# Altium project MC3_r2.PrjPcb (part 10 of 10)

## Sheet FaultOptoNO.SchDoc
size Letter; Organization: Altium Limited; Address1: L3, 12a Rodborough Rd; Address2: Frenchs Forest; Address3: NSW; Address4: Australia 2086; DocumentNumber: D_10; SheetNumber: 10; SheetTotal: 21
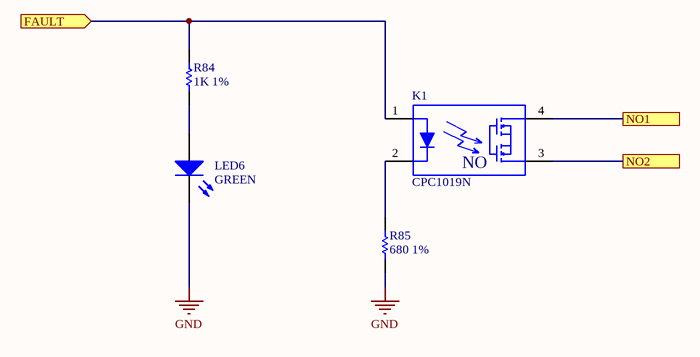
[diagram p20: FaultOptoNO.SchDoc]

### Parts
K1  CPC1019N  [SOP254P610X206-4N]
LED6  GREEN  [LED0805]
R84  1K 1%  [R0805]
R85  680 1%  [R0805]

### Ports
FAULT (in), NO1, NO2

### Nets
GND: LED6.1(K) R85.1
COOL_RET: K1.3 ; port NO2
COOL_TEMP_INa: K1.4 ; port NO1
F_Cool-Short: K1.1 R84.1 ; port FAULT
NetK1_2: K1.2 R85.2
NetLED6_2: LED6.2(A) R84.2

### Notes on the sheet
- Title
- Size:
- Date:
- Letter
- Number:
- Time:
- Revision:
- Sheet
- of
- Fluid Power Training
- Institute Inc.
- 2170 S 3040 W
- Salt Lake City, 84119,UT.
- United States.
- File:
- (in symbol CPC1019N) NO

### Library data of the parts
K1 = CPC1019N: Relay SSR 50mA 1.4V DC-IN 0.75A 60V AC-OUT 4-Pin SOP Tube; Manufacturer: Ixys Clare; Output Current: 750mA; Throw Configuration: SPST; Isolation Voltage: 1.5kV; Supplier 1: Mouser; Supplier Part Number 1: 849-CPC1019N; Manufacturer Part Number: CPC1019N; RoHS: Yes; Category: Solid State Relays; Stock 1: 6539; Pricing 1: 1=1.76000, 10=1.61000, 20=1.47000, 50=1.41000, 100=1.34000, 200=1.19000 (USD); Mount: Surface Mount; Case/Package: SOP; Number of Pins: 4; Min Operating Temperature: -40°C; Max Operating Temperature: 85°C; Packaging: Rail/Tube; Package Quantity: 100; Termination: Gull Wing; Max Output Voltage: 60V; Input Current: 50mA; Length: 4.089mm; Height: 2.184mm; Width: 3.8mm; Radiation Hardening: No; ComponentLink1URL: http://components.arrow.com/part/dataview/0323_06647336?src-supplier=Arrow+Europe; ComponentLink1Description: http://components.arrow.com/part/dataview/0323_06647336?src-supplier=Arrow+Europe; ComponentLink2URL: http://www.mouser.com/ds/2/205/CPC1019N-594134.pdf?src-supplier=Mouser; ComponentLink2Description: http://www.mouser.com/ds/2/205/CPC1019N-594134.pdf?src-supplier=Mouser; ComponentLink3URL: http://components.arrow.com/part/dataview/47904908S477565N2018?src-supplier=Arrow; ComponentLink3Description: http://components.arrow.com/part/dataview/47904908S477565N2018?src-supplier=Arrow; ComponentLink4URL: http://www.ixysic.com/home/pdfs.nsf/www/CPC1019N.pdf/$file/CPC1019N.pdf?src-supplier=Digi-Key; ComponentLink4Description: http://www.ixysic.com/home/pdfs.nsf/www/CPC1019N.pdf/$file/CPC1019N.pdf?src-supplier=Digi-Key
LED6 = 150080VS75000: LED GREEN CLEAR 0805 SMD; Manufacturer: Wurth Electronics; Viewing Angle: 140°; Lens Style: Clear,Rectangular; Forward Voltage: 2V; Luminous Intensity: 40mcd; Dominant Wavelength: 570nm; Forward Current: 30mA; Test Current: 20mA; Supplier 1: Mouser; Supplier Part Number 1: 710-150080VS75000; Manufacturer Part Number: 150080VS75000; RoHS: Yes; Category: LEDs; Stock 1: 16574; Pricing 1: 1=0.18000, 10=0.17500, 25=0.17400, 50=0.16200, 100=0.13900, 250=0.12300 (USD); Mount: Surface Mount; Case/Package: 0805; Color: Green; Case Code (Metric): 2012; Case Code (Imperial): 0805; Min Operating Temperature: -40°C; Max Operating Temperature: 85°C; Packaging: Tape and Reel; Package Quantity: 4000; Wavelength: 570nm; Length: 2mm; Height: 0.7mm; Width: 1.25mm; REACH SVHC: Unknown; ComponentLink1URL: https://datasheet.ciiva.com/22656/150080vs75000-22656966.pdf?src-supplier=Element14; ComponentLink1Description: https://datasheet.ciiva.com/22656/150080vs75000-22656966.pdf?src-supplier=Element14; ComponentLink2URL: https://datasheet.ciiva.com/29279/759437-da-01-en-chipled-0805-w-kl-h-gruen-150080vs7500-29279047.pdf?src-supplier=Conrad; ComponentLink2Description: https://datasheet.ciiva.com/29279/759437-da-01-en-chipled-0805-w-kl-h-gruen-150080vs7500-29279047.pdf?src-supplier=Conrad; ComponentLink3URL: https://datasheet.ciiva.com/29563/150080vs75000-29563018.pdf?src-supplier=Digi-Key; ComponentLink3Description: https://datasheet.ciiva.com/29563/150080vs75000-29563018.pdf?src-supplier=Digi-Key
R84 = RC0805FR-071KL: RESISTOR, 0805 1K 1%, FULL REEL; Product Range:YAGEO - RC Series; Resistance:1kohm; Power Rating:125mW; Resistance Tolerance:± 1%; Resistor Case Style:0805 [2012 Metric]; Resistor Element Material:Thick Film; Temperature Coefficient:± 250ppm/°C; Voltage Rating:150V; Packaging:Tape & Reel; MSL:-; SVHC:No SVHC (16-Dec-2013); External Depth:0.55mm; External Length / Height:2mm; External Width:1.25mm; No. of Pins:2; Operating Temperature Max:155°C; Operating Temperature Min:-55°C; Operating Temperature Range:-55°C to +155°C; Reel Quantity:5000; Resistor Mounting:SMD; Series:RC12H; Temperature Coef; Manufacturer: Yageo; Resistance: 1kR; Temperature Coefficient: 100ppm/°C; Power Rating: 125mW; Voltage Rating: 150V; Supplier 1: Mouser; Manufacturer Part Number: RC0805FR-071KL; RoHS: Yes; Stock 1: 1519412; Pricing 1: 1=0.13000, 10=0.03100, 100=0.01100, 1000=0.00800, 5000=0.00500, 10000=0.00500 (USD); ComponentLink1URL: https://datasheet.ciiva.com/2456/pyu-r-int-thick-7-2456976.pdf?src-supplier=Digi-Key; ComponentLink1Description: https://datasheet.ciiva.com/2456/pyu-r-int-thick-7-2456976.pdf?src-supplier=Digi-Key; ComponentLink2URL: https://datasheet.ciiva.com/2456/pyu-r-int-thick-7-2456977.pdf?src-supplier=Digi-Key; ComponentLink2Description: https://datasheet.ciiva.com/2456/pyu-r-int-thick-7-2456977.pdf?src-supplier=Digi-Key; Supplier Part Number 1: 603-RC0805FR-071KL; Category: Chip SMD Resistors; Case/Package: 0805; Case Code (Imperial): 0805; Case Code (Metric): 2012; Min Operating Temperature: -55°C; Max Operating Temperature: 155°C; Tolerance: 1%; Packaging: Tape and Reel; Composition: Thick Film; Termination: SMD/SMT; Voltage Rating (DC): 150V; Package Quantity: 1; Military Standard: Not; Length: 0.079inch; Height: 0.024inch; Width: 0.049inch; Depth: 1.25mm; Lead Free: Lead Free; REACH SVHC: Unknown; ComponentLink3URL: https://datasheet.ciiva.com/7941/1686128-7941719.pdf?src-supplier=Element14; ComponentLink3Description: https://datasheet.ciiva.com/7941/1686128-7941719.pdf?src-supplier=Element14; ComponentLink4URL: https://datasheet.ciiva.com/16850/rc0805-16850409.pdf?src-supplier=Future+Electronics; ComponentLink4Description: https://datasheet.ciiva.com/16850/rc0805-16850409.pdf?src-supplier=Future+Electronics; ComponentLink5URL: https://datasheet.ciiva.com/46385/444164-46385020.pdf?src-supplier=Element14; ComponentLink5Description: https://datasheet.ciiva.com/46385/444164-46385020.pdf?src-supplier=Element14; ComponentLink6URL: https://datasheet.ciiva.com/2456/pyu-r-int-thick-7-2456975.pdf?src-supplier=Digi-Key; ComponentLink6Description: https://datasheet.ciiva.com/2456/pyu-r-int-thick-7-2456975.pdf?src-supplier=Digi-Key; Number of Pins: 2; Number of Terminations: 2; Max Power Dissipation: 125mW; Features: Moisture Resistant
R85 = ERJ6ENF6800V: 680 ohm, 125 mW,  1%, 150 V,PANASONIC ELECTRONIC COMPONENTS         ERJ6ENF6800V            Surface Mount Chip Resistor, Thick Film, AEC-Q200 ERJ6E Series,; Resistance: 680R; Temperature Coefficient: 100ppm/°C; Power Rating: 125mW; Voltage Rating: 150V; Supplier 1: Mouser; Supplier Part Number 1: 667-ERJ-6ENF6800V; Manufacturer: Panasonic; Manufacturer Part Number: ERJ6ENF6800V; RoHS: Yes; Category: Chip SMD Resistors; Stock 1: 59996; Pricing 1: 1=0.11000, 10=0.07200, 100=0.02800, 1000=0.01900, 5000=0.01700, 10000=0.01500 (USD); Mount: Surface Mount; Case/Package: 0805; Number of Pins: 2; Case Code (Metric): 2012; Case Code (Imperial): 0805; Contact Plating: Tin; Min Operating Temperature: -55°C; Max Operating Temperature: 155°C; Packaging: Tape and Reel; Tolerance: 1%; Composition: Thick Film; Termination: SMD/SMT; Number of Terminations: 2; Max Power Dissipation: 125mW; Package Quantity: 1; Features: Automotive AEC-Q200; Military Standard: Not; Length: 2mm; Height: 0.6mm; Width: 0.049inch; Depth: 1.25mm; Radiation Hardening: No; REACH SVHC: No SVHC; ComponentLink1URL: https://datasheet.ciiva.com/11821/0900766b80f80784-11821688.pdf?src-supplier=RSComponents; ComponentLink1Description: https://datasheet.ciiva.com/11821/0900766b80f80784-11821688.pdf?src-supplier=RSComponents; ComponentLink2URL: https://datasheet.ciiva.com/16787/70260748-16787589.pdf?src-supplier=Allied+Electronics; ComponentLink2Description: https://datasheet.ciiva.com/16787/70260748-16787589.pdf?src-supplier=Allied+Electronics; ComponentLink3URL: https://datasheet.ciiva.com/9180/aoa0000ce2-9180429.pdf?src-supplier=Avnet; ComponentLink3Description: https://datasheet.ciiva.com/9180/aoa0000ce2-9180429.pdf?src-supplier=Avnet; ComponentLink4URL: https://datasheet.ciiva.com/7944/426256-7944661.pdf?src-supplier=Element14; ComponentLink4Description: https://datasheet.ciiva.com/7944/426256-7944661.pdf?src-supplier=Element14; ComponentLink5URL: https://datasheet.ciiva.com/16512/aoa0000ce2-16512058.pdf?src-supplier=Avnet+Asia; ComponentLink5Description: https://datasheet.ciiva.com/16512/aoa0000ce2-16512058.pdf?src-supplier=Avnet+Asia; ComponentLink6URL: https://datasheet.ciiva.com/16757/70260748-16757933.pdf?src-supplier=Allied+Electronics; ComponentLink6Description: https://datasheet.ciiva.com/16757/70260748-16757933.pdf?src-supplier=Allied+Electronics; ComponentLink7URL: https://datasheet.ciiva.com/30107/aoa0000ce2-30107005.pdf?src-supplier=Onlinecomponents.com; ComponentLink7Description: https://datasheet.ciiva.com/30107/aoa0000ce2-30107005.pdf?src-supplier=Onlinecomponents.com; ComponentLink8URL: https://datasheet.ciiva.com/46373/1678782-46373887.pdf?src-supplier=Element14; ComponentLink8Description: https://datasheet.ciiva.com/46373/1678782-46373887.pdf?src-supplier=Element14; ComponentLink9URL: https://datasheet.ciiva.com/17205/aoa0000ce2-17205287.pdf?src-supplier=Avnet+Europe; ComponentLink9Description: https://datasheet.ciiva.com/17205/aoa0000ce2-17205287.pdf?src-supplier=Avnet+Europe; ComponentLink10URL: https://datasheet.ciiva.com/7944/426256-7944953.pdf?src-supplier=Element14; ComponentLink10Description: https://datasheet.ciiva.com/7944/426256-7944953.pdf?src-supplier=Element14; ComponentLink11URL: https://datasheet.ciiva.com/5860/426256-5860698.pdf?src-supplier=Farnell; ComponentLink11Description: https://datasheet.ciiva.com/5860/426256-5860698.pdf?src-supplier=Farnell; ComponentLink12URL: https://datasheet.ciiva.com/46373/1678782-46373886.pdf?src-supplier=Element14; ComponentLink12Description: https://datasheet.ciiva.com/46373/1678782-46373886.pdf?src-supplier=Element14

## Nets that join several sheets
+3V3: Main_Connectors (C3.1 X2.26), MC3_microcontroller (18 pins), I2cLevelShifter (6 pins), RPM Inputs (OK1.4 R39.2), AD_Sensors (D7.2), DigitalInputs (R76.2), DCMotorControl (C68.1 IC2.6), TPS_secondary_wiper (C70.1 U17.5), PowerSupply (7 pins)
+5V: Main_Connectors (X2.19 X2.20), I2cLevelShifter (R81.2 R88.2 R95.2), AD_starter_alternator (5 pins), U_MC3_blocks/U_MC3_module/U_CAN2 (C12_U_CAN2.2 C13_U_CAN2.2 U3_U_CAN2.3), PowerSupply (10 pins)
+5VSW: U_MC3_blocks/U_MC3_module/U_CAN (C12_U_CAN.2 C13_U_CAN.2 U3_U_CAN.3), RPM Inputs (C26.1 U4.5), AD_Sensors (6 pins), PowerSupply (C51.2 TP10.1 U14.1)
+8VREF: AD_Sensors (11 pins), PowerSupply (C55.1 TP12.1 U16.1)
+V24V: Main_Connectors (X1.1 X1.3 X1.5), MC_Connector (D4.1), U_MC3_blocks/U_MC3_module/U_MC_Connector/RLA (RL3_RLA.1), U_MC3_blocks/U_MC3_module/U_MC_Connector/RLB (RL3_RLB.1), U_MC3_blocks/U_MC3_module/U_MC_Connector/RLC (RL3_RLC.1), U_MC3_blocks/U_MC3_module/U_MC_Connector/RLD (RL3_RLD.1), U_MC3_blocks/U_MC3_module/U_MC_Connector/RLE (RL3_RLE.1), U_MC3_blocks/U_MC3_module/U_MC_Connector/RLF (RL3_RLF.1), PowerSupply (C44.1 C45.2 D9.2 U12.1), CanFaults (C14.2 C15.2 C16.2), U_MC3_blocks/U_CanFaults/A1P (D3_A1P.2 R32_A1P.1 RL2_A1P.1), U_MC3_blocks/U_CanFaults/A1N (D3_A1N.2 R32_A1N.1 RL2_A1N.1), U_MC3_blocks/U_CanFaults/B1P (D3_B1P.2 R32_B1P.1 RL2_B1P.1), U_MC3_blocks/U_CanFaults/B1N (D3_B1N.2 R32_B1N.1 RL2_B1N.1), U_MC3_blocks/U_CanFaults/C1P (D3_C1P.2 R32_C1P.1 RL2_C1P.1), U_MC3_blocks/U_CanFaults/C1N (D3_C1N.2 R32_C1N.1 RL2_C1N.1), U_MC3_blocks/U_CanFaults/CONA (D2_CONA.2 RL1_CONA.1), U_MC3_blocks/U_CanFaults/CONB (D2_CONB.2 RL1_CONB.1), U_MC3_blocks/U_CanFaults/CONC (D2_CONC.2 RL1_CONC.1)
+V24V_IN: Main_Connectors (X2.1 X2.3), PowerSupply (D9.1)
GND: Main_Connectors (10 pins), MC3_module (7 pins), U_MC3_blocks/U_MC3_module/U_CAN (5 pins), MC3_microcontroller (32 pins), RPM Inputs (10 pins), AD_starter_alternator (10 pins), AD_Sensors (30 pins), DigitalInputs (C57.2 D11.1 Q13.2 R78.1), MC_Connector (Q3.2), DCMotorControl (9 pins), TPS_secondary_wiper (5 pins), U_MC3_blocks/U_MC3_module/U_CAN2 (5 pins), PowerSupply (19 pins), CanFaults (9 pins), U_MC3_blocks/U_CanFaults/A1P (Q2_A1P.2), U_MC3_blocks/U_CanFaults/A1N (Q2_A1N.2), U_MC3_blocks/U_CanFaults/B1P (Q2_B1P.2), U_MC3_blocks/U_CanFaults/B1N (Q2_B1N.2), U_MC3_blocks/U_CanFaults/C1P (Q2_C1P.2), U_MC3_blocks/U_CanFaults/C1N (Q2_C1N.2), U_MC3_blocks/U_CanFaults/CONA (Q1_CONA.2), U_MC3_blocks/U_CanFaults/CONB (Q1_CONB.2), U_MC3_blocks/U_CanFaults/CONC (Q1_CONC.2), U_MC3_blocks/U_Fault_Module/U_FaultOptoNC (LED7_U_MC3_blocks_U_Fault_Module_U_FaultOptoNC#1.1 R87_U_MC3_blocks_U_Fault_Module_U_FaultOptoNC#1.1), U_MC3_blocks/U_Fault_Module/U_FaultOptoNC (LED7_U_MC3_blocks_U_Fault_Module_U_FaultOptoNC#2.1 R87_U_MC3_blocks_U_Fault_Module_U_FaultOptoNC#2.1), U_MC3_blocks/U_Fault_Module/U_FaultOptoNC (LED7_U_MC3_blocks_U_Fault_Module_U_FaultOptoNC#3.1 R87_U_MC3_blocks_U_Fault_Module_U_FaultOptoNC#3.1), FaultOptoNO (LED6.1 R85.1)
~{SPEED_DIAG}: MC3_microcontroller (U1.11), RPM Inputs (Q4.1)
~{SPEED_EN}: MC3_microcontroller (U1.10), RPM Inputs (U4.4)
AD_MOTOR: MC3_microcontroller (U1.27), DCMotorControl (C69.1 R92.1)
ADSRDY: MC3_microcontroller (U1.57), I2cLevelShifter (Q18.2 R94.1 TP18.1)
ADSRDY5V: I2cLevelShifter (Q18.3 R95.1 TP19.1), AD_starter_alternator (IC1.2)
ALTERNATOR_AMP: Main_Connectors (X2.22), MC3_module (BH37.1), AD_starter_alternator (R33.1 R34.2)
ALTERNATOR_VREF: Main_Connectors (X2.18), AD_starter_alternator (R35.1)
B_CANH_A: CanFaults (BH1.1 R14.2), U_MC3_blocks/U_CanFaults/A1P (RL2_A1P.2 RL2_A1P.6), U_MC3_blocks/U_CanFaults/CONA (RL1_CONA.2)
B_CANH_B: CanFaults (BH4.1 R20.2), U_MC3_blocks/U_CanFaults/B1P (RL2_B1P.2 RL2_B1P.6), U_MC3_blocks/U_CanFaults/CONB (RL1_CONB.2)
B_CANH_TEST: CanFaults (BH3.1), U_MC3_blocks/U_CanFaults/CONA (RL1_CONA.4), U_MC3_blocks/U_CanFaults/CONB (RL1_CONB.4), U_MC3_blocks/U_CanFaults/CONC (RL1_CONC.4)
B_CANL_A: CanFaults (BH2.1 R17.2 R18.1), U_MC3_blocks/U_CanFaults/A1N (RL2_A1N.2 RL2_A1N.6), U_MC3_blocks/U_CanFaults/CONA (RL1_CONA.7)
B_CANL_B: CanFaults (BH6.1 R23.2 R24.1), U_MC3_blocks/U_CanFaults/B1N (RL2_B1N.2 RL2_B1N.6), U_MC3_blocks/U_CanFaults/CONB (RL1_CONB.7)
B_CANL_TEST: CanFaults (BH5.1), U_MC3_blocks/U_CanFaults/CONA (RL1_CONA.5), U_MC3_blocks/U_CanFaults/CONB (RL1_CONB.5), U_MC3_blocks/U_CanFaults/CONC (RL1_CONC.5)
CAN1_RX: U_MC3_blocks/U_MC3_module/U_CAN (R13_U_CAN.1), MC3_microcontroller (U1.44)
CAN1_TX: U_MC3_blocks/U_MC3_module/U_CAN (R10_U_CAN.1), MC3_microcontroller (U1.45)
CAN2_RX: MC3_microcontroller (U1.33), U_MC3_blocks/U_MC3_module/U_CAN2 (R13_U_CAN2.1)
CAN2_TX: MC3_microcontroller (U1.34), U_MC3_blocks/U_MC3_module/U_CAN2 (R10_U_CAN2.1)
CONA: MC3_microcontroller (U1.28), U_MC3_blocks/U_CanFaults/CONA (Q1_CONA.1)
CONB: MC3_microcontroller (U1.29), U_MC3_blocks/U_CanFaults/CONB (Q1_CONB.1)
CONC: MC3_microcontroller (U1.30), U_MC3_blocks/U_CanFaults/CONC (Q1_CONC.1)
COOL_AD: MC3_microcontroller (U1.21), AD_Sensors (C32.1 R51.2 R53.2)
COOL_RET: Main_Connectors (X2.31), MC_Connector (BH16.1), U_MC3_blocks/U_MC3_module/U_MC_Connector/RLB (RL3_RLB.2), FaultOptoNO (K1.3)
COOL_RET: MC3_module (F2.1), U_MC3_blocks/U_MC3_module/U_MC_Connector/RLB (RL3_RLB.3)
COOL_TEMP_IN: Main_Connectors (X2.33), U_MC3_blocks/U_Fault_Module/U_FaultOptoNC (K2_U_MC3_blocks_U_Fault_Module_U_FaultOptoNC#3.3)
COOL_TEMP_IN: AD_Sensors (R48.1 R49.1), U_MC3_blocks/U_MC3_module/U_MC_Connector/RLC (RL3_RLC.6)
COOL_TEMP_INa: MC_Connector (BH18.1), U_MC3_blocks/U_MC3_module/U_MC_Connector/RLC (RL3_RLC.7), U_MC3_blocks/U_Fault_Module/U_FaultOptoNC (K2_U_MC3_blocks_U_Fault_Module_U_FaultOptoNC#3.4), FaultOptoNO (K1.4)
CTRL_CANH: Main_Connectors (X2.9 X2.10), U_MC3_blocks/U_MC3_module/U_CAN2 (ESD1_U_CAN2.1 R12_U_CAN2.2 U3_U_CAN2.7)
CTRL_CANL: Main_Connectors (X2.11 X2.12), U_MC3_blocks/U_MC3_module/U_CAN2 (ESD1_U_CAN2.2 R12_U_CAN2.1 U3_U_CAN2.6)
F_Cool-Short: MC3_microcontroller (U1.50), FaultOptoNO (K1.1 R84.1)
F_Cool_Open: MC3_microcontroller (U1.51), U_MC3_blocks/U_Fault_Module/U_FaultOptoNC (K2_U_MC3_blocks_U_Fault_Module_U_FaultOptoNC#3.1 R86_U_MC3_blocks_U_Fault_Module_U_FaultOptoNC#3.1)
F_Speed1_Open: MC3_microcontroller (U1.53), U_MC3_blocks/U_Fault_Module/U_FaultOptoNC (K2_U_MC3_blocks_U_Fault_Module_U_FaultOptoNC#1.1 R86_U_MC3_blocks_U_Fault_Module_U_FaultOptoNC#1.1)
F_TPS_Intermitent: MC3_microcontroller (U1.52), U_MC3_blocks/U_Fault_Module/U_FaultOptoNC (K2_U_MC3_blocks_U_Fault_Module_U_FaultOptoNC#2.1 R86_U_MC3_blocks_U_Fault_Module_U_FaultOptoNC#2.1)
FAULTAH: MC3_microcontroller (U1.43), U_MC3_blocks/U_CanFaults/A1P (Q2_A1P.1)
FAULTAL: MC3_microcontroller (U1.42), U_MC3_blocks/U_CanFaults/A1N (Q2_A1N.1)
FAULTBH: MC3_microcontroller (U1.41), U_MC3_blocks/U_CanFaults/B1P (Q2_B1P.1)
FAULTBL: MC3_microcontroller (U1.40), U_MC3_blocks/U_CanFaults/B1N (Q2_B1N.1)
FAULTCH: MC3_microcontroller (U1.39), U_MC3_blocks/U_CanFaults/C1P (Q2_C1P.1)
FAULTCL: MC3_microcontroller (U1.38), U_MC3_blocks/U_CanFaults/C1N (Q2_C1N.1)
IGNITION: Main_Connectors (X2.15), MC3_module (BH36.1), DigitalInputs (R77.1 R78.2)
LED_CONNECTOR: Main_Connectors (X2.4), MC_Connector (D4.2 Q3.3), U_MC3_blocks/U_MC3_module/U_MC_Connector/RLA (RL3_RLA.8), U_MC3_blocks/U_MC3_module/U_MC_Connector/RLB (RL3_RLB.8), U_MC3_blocks/U_MC3_module/U_MC_Connector/RLC (RL3_RLC.8), U_MC3_blocks/U_MC3_module/U_MC_Connector/RLD (RL3_RLD.8), U_MC3_blocks/U_MC3_module/U_MC_Connector/RLE (RL3_RLE.8), U_MC3_blocks/U_MC3_module/U_MC_Connector/RLF (RL3_RLF.8)
LEDA: Main_Connectors (X1.2), U_MC3_blocks/U_CanFaults/CONA (D2_CONA.1 Q1_CONA.3 RL1_CONA.8)
LEDB: Main_Connectors (X1.4), U_MC3_blocks/U_CanFaults/CONB (D2_CONB.1 Q1_CONB.3 RL1_CONB.8)
LEDC: Main_Connectors (X1.6), U_MC3_blocks/U_CanFaults/CONC (D2_CONC.1 Q1_CONC.3 RL1_CONC.8)
MC2_MC3_CANH: Main_Connectors (X2.6), CanFaults (BH7.1 R26.1), U_MC3_blocks/U_CanFaults/C1P (RL2_C1P.3)
MC2_MC3_CANL: Main_Connectors (X2.8), CanFaults (BH8.1 R29.1), U_MC3_blocks/U_CanFaults/C1N (RL2_C1N.3)
MOTOR+: Main_Connectors (X2.14), DCMotorControl (D12.1 Q14.3)
MOTOR-: Main_Connectors (X2.13), DCMotorControl (IC2.3 R93.2)
NetBH9_1: MC_Connector (BH9.1), U_MC3_blocks/U_MC3_module/U_MC_Connector/RLA (RL3_RLA.5)
NetBH11_1: MC_Connector (BH11.1), U_MC3_blocks/U_MC3_module/U_MC_Connector/RLA (RL3_RLA.4)
NetBH13_1: MC_Connector (BH13.1), U_MC3_blocks/U_MC3_module/U_MC_Connector/RLB (RL3_RLB.5)
NetBH15_1: MC_Connector (BH15.1), U_MC3_blocks/U_MC3_module/U_MC_Connector/RLB (RL3_RLB.4)
NetBH17_1: MC_Connector (BH17.1), U_MC3_blocks/U_MC3_module/U_MC_Connector/RLC (RL3_RLC.5)
NetBH19_1: MC_Connector (BH19.1), U_MC3_blocks/U_MC3_module/U_MC_Connector/RLC (RL3_RLC.4)
NetBH21_1: MC_Connector (BH21.1), U_MC3_blocks/U_MC3_module/U_MC_Connector/RLD (RL3_RLD.5)
NetBH23_1: MC_Connector (BH23.1), U_MC3_blocks/U_MC3_module/U_MC_Connector/RLD (RL3_RLD.4)
NetBH25_1: MC_Connector (BH25.1), U_MC3_blocks/U_MC3_module/U_MC_Connector/RLE (RL3_RLE.5)
NetBH27_1: MC_Connector (BH27.1), U_MC3_blocks/U_MC3_module/U_MC_Connector/RLE (RL3_RLE.4)
NetBH29_1: MC_Connector (BH29.1), U_MC3_blocks/U_MC3_module/U_MC_Connector/RLF (RL3_RLF.5)
NetBH31_1: MC_Connector (BH31.1), U_MC3_blocks/U_MC3_module/U_MC_Connector/RLF (RL3_RLF.4)
NetBH35_1: MC3_module (BH35.1), U_MC3_blocks/U_MC3_module/U_CAN (ESD1_U_CAN.1 R12_U_CAN.2 U3_U_CAN.7), CanFaults (R20.1), U_MC3_blocks/U_CanFaults/B1P (RL2_B1P.3)
NetBH39_1: MC3_module (BH39.1), U_MC3_blocks/U_MC3_module/U_CAN (ESD1_U_CAN.2 R12_U_CAN.1 U3_U_CAN.6), CanFaults (R23.1), U_MC3_blocks/U_CanFaults/B1N (RL2_B1N.3)
NetIC1_9: I2cLevelShifter (Q16.3 R81.1 TP15.1), AD_starter_alternator (IC1.9)
NetIC1_10: I2cLevelShifter (Q17.3 R88.1 TP17.1), AD_starter_alternator (IC1.10)
NetR15_2: CanFaults (R15.2 R16.2), U_MC3_blocks/U_CanFaults/A1P (RL2_A1P.5)
NetR16_1: CanFaults (R16.1 R18.2 R19.2), U_MC3_blocks/U_CanFaults/A1N (RL2_A1N.5)
NetR21_2: CanFaults (R21.2 R22.2), U_MC3_blocks/U_CanFaults/B1P (RL2_B1P.5)
NetR22_1: CanFaults (R22.1 R24.2 R25.2), U_MC3_blocks/U_CanFaults/B1N (RL2_B1N.5)
NetR26_2: CanFaults (R26.2), U_MC3_blocks/U_CanFaults/C1P (RL2_C1P.2 RL2_C1P.6), U_MC3_blocks/U_CanFaults/CONC (RL1_CONC.2)
NetR27_2: CanFaults (R27.2 R28.2), U_MC3_blocks/U_CanFaults/C1P (RL2_C1P.5)
NetR28_1: CanFaults (R28.1 R30.2 R31.2), U_MC3_blocks/U_CanFaults/C1N (RL2_C1N.5)
NetR29_2: CanFaults (R29.2 R30.1), U_MC3_blocks/U_CanFaults/C1N (RL2_C1N.2 RL2_C1N.6), U_MC3_blocks/U_CanFaults/CONC (RL1_CONC.7)
NetRL1_CONA_3: U_MC3_blocks/U_CanFaults/CONA (RL1_CONA.3), U_MC3_blocks/U_CanFaults/CONB (RL1_CONB.3), U_MC3_blocks/U_CanFaults/CONC (RL1_CONC.3)
NetRL1_CONA_6: U_MC3_blocks/U_CanFaults/CONA (RL1_CONA.6), U_MC3_blocks/U_CanFaults/CONB (RL1_CONB.6), U_MC3_blocks/U_CanFaults/CONC (RL1_CONC.6)
nFault5VSW: MC3_microcontroller (U1.9), PowerSupply (R71.1 U14.3)
nIGNITION: MC3_microcontroller (U1.3), DigitalInputs (C57.1 Q13.3 R76.1)
nMC3Power: MC3_microcontroller (U1.8), PowerSupply (Q12.3 R73.1 U14.4)
OIL_PRESS_IN: Main_Connectors (X2.36), MC_Connector (BH22.1), U_MC3_blocks/U_MC3_module/U_MC_Connector/RLD (RL3_RLD.7)
OIL_PRESS_IN: AD_Sensors (R54.1 R55.1), U_MC3_blocks/U_MC3_module/U_MC_Connector/RLD (RL3_RLD.6)
OIL_RET: Main_Connectors (X2.34), MC_Connector (BH20.1), U_MC3_blocks/U_MC3_module/U_MC_Connector/RLC (RL3_RLC.2)
OIL_RET: MC3_module (F3.1), U_MC3_blocks/U_MC3_module/U_MC_Connector/RLC (RL3_RLC.3)
OILPRESSAD: MC3_microcontroller (U1.17), AD_Sensors (C36.1 R56.2 R58.2)
Open_Connector: MC3_microcontroller (U1.54), MC_Connector (Q3.1)
PWM_MOTOR: MC3_microcontroller (U1.37), DCMotorControl (Q15.1 R91.2)
SCL: MC3_microcontroller (U1.61 U2.6), I2cLevelShifter (Q17.2 R82.1 TP16.1)
SDA: MC3_microcontroller (U1.62 U2.5), I2cLevelShifter (Q16.2 R6.1 TP14.1)
SHDN_COOL: MC3_microcontroller (U1.26), AD_Sensors (R52.1)
SHDN_OIL: MC3_microcontroller (U1.24), AD_Sensors (R59.1)
SHDN_TPS: MC3_microcontroller (U1.25), AD_Sensors (R64.1)
SPEED1_IN: Main_Connectors (X2.37), U_MC3_blocks/U_Fault_Module/U_FaultOptoNC (K2_U_MC3_blocks_U_Fault_Module_U_FaultOptoNC#1.3)
SPEED1_IN: RPM Inputs (R41.1), U_MC3_blocks/U_MC3_module/U_MC_Connector/RLE (RL3_RLE.6)
SPEED1_INa: MC_Connector (BH26.1), U_MC3_blocks/U_MC3_module/U_MC_Connector/RLE (RL3_RLE.7), U_MC3_blocks/U_Fault_Module/U_FaultOptoNC (K2_U_MC3_blocks_U_Fault_Module_U_FaultOptoNC#1.4)
SPEED1_RET: Main_Connectors (X2.35), MC_Connector (BH24.1), U_MC3_blocks/U_MC3_module/U_MC_Connector/RLD (RL3_RLD.2)
SPEED1_RET: MC3_module (F4.1), U_MC3_blocks/U_MC3_module/U_MC_Connector/RLD (RL3_RLD.3)
SPEED2_IN: Main_Connectors (X2.40), MC_Connector (BH30.1), U_MC3_blocks/U_MC3_module/U_MC_Connector/RLF (RL3_RLF.7)
SPEED2_IN: RPM Inputs (OK1.2), U_MC3_blocks/U_MC3_module/U_MC_Connector/RLF (RL3_RLF.6)
SPEED2_RET: Main_Connectors (X2.38), MC_Connector (BH28.1), U_MC3_blocks/U_MC3_module/U_MC_Connector/RLE (RL3_RLE.2)
SPEED2_RET: MC3_module (F6.1), U_MC3_blocks/U_MC3_module/U_MC_Connector/RLE (RL3_RLE.3)
SPEED2_VBAT: Main_Connectors (X2.39), MC_Connector (BH32.1), U_MC3_blocks/U_MC3_module/U_MC_Connector/RLF (RL3_RLF.2)
SPEED2_VBAT: MC3_module (F7.2), RPM Inputs (R46.2), U_MC3_blocks/U_MC3_module/U_MC_Connector/RLF (RL3_RLF.3)
SPEED_HALL: MC3_microcontroller (U1.15), RPM Inputs (OK1.3 R47.2 TP4.1)
SPEED_RLC: MC3_microcontroller (U1.14), RPM Inputs (R42.2)
STARTER_AMP: Main_Connectors (X2.21), MC3_module (BH38.1), AD_starter_alternator (R36.1 R37.2)
STARTER_VREF: Main_Connectors (X2.17), AD_starter_alternator (R38.1)
TESTCONNECTOR_CANH: Main_Connectors (X2.5), CanFaults (R14.1), U_MC3_blocks/U_CanFaults/A1P (RL2_A1P.3)
TESTCONNECTOR_CANL: Main_Connectors (X2.7), CanFaults (R17.1), U_MC3_blocks/U_CanFaults/A1N (RL2_A1N.3)
TPS_5VREF: Main_Connectors (X2.32), MC_Connector (BH14.1), U_MC3_blocks/U_MC3_module/U_MC_Connector/RLB (RL3_RLB.7)
TPS_5VREF: AD_Sensors (5 pins), U_MC3_blocks/U_MC3_module/U_MC_Connector/RLB (RL3_RLB.6)
TPS_RET: Main_Connectors (X2.30), MC_Connector (BH10.1), U_MC3_blocks/U_MC3_module/U_MC_Connector/RLA (RL3_RLA.7)
TPS_RET: MC3_module (F1.1), U_MC3_blocks/U_MC3_module/U_MC_Connector/RLA (RL3_RLA.6)
TPS_SEC: Main_Connectors (X2.25), TPS_secondary_wiper (R9.1 R80.2)
TPS_SECAD: MC3_microcontroller (U1.23), TPS_secondary_wiper (C64.1 R79.2 TP13.1)
TPS_WIPER: Main_Connectors (X2.29), U_MC3_blocks/U_Fault_Module/U_FaultOptoNC (K2_U_MC3_blocks_U_Fault_Module_U_FaultOptoNC#2.3)
TPS_WIPER: AD_Sensors (R66.1 R83.2), U_MC3_blocks/U_MC3_module/U_MC_Connector/RLA (RL3_RLA.3)
TPS_WIPERa: MC_Connector (BH12.1), U_MC3_blocks/U_MC3_module/U_MC_Connector/RLA (RL3_RLA.2), U_MC3_blocks/U_Fault_Module/U_FaultOptoNC (K2_U_MC3_blocks_U_Fault_Module_U_FaultOptoNC#2.4)
TPSAD: MC3_microcontroller (U1.20), AD_Sensors (C43.1 R67.2 R68.2)
UART_RX1: MC3_module (P1.4), MC3_microcontroller (U1.59)
UART_TX1: MC3_module (P1.5), MC3_microcontroller (U1.58)
VBATS_AD: MC3_microcontroller (U1.22), AD_Sensors (C41.1 D7.1 R61.2 R62.2)
VBATT_: Main_Connectors (X2.16), MC3_module (F7.1 F8.2), AD_Sensors (R61.1), DCMotorControl (Q14.2 R89.2), PowerSupply (C53.2 C54.1 R74.1 U16.3)

## Assembly variants
Production: not fitted R38 R40 R42 R45 R46 R47 R48 R49 R50 R51 R52 R53 R54